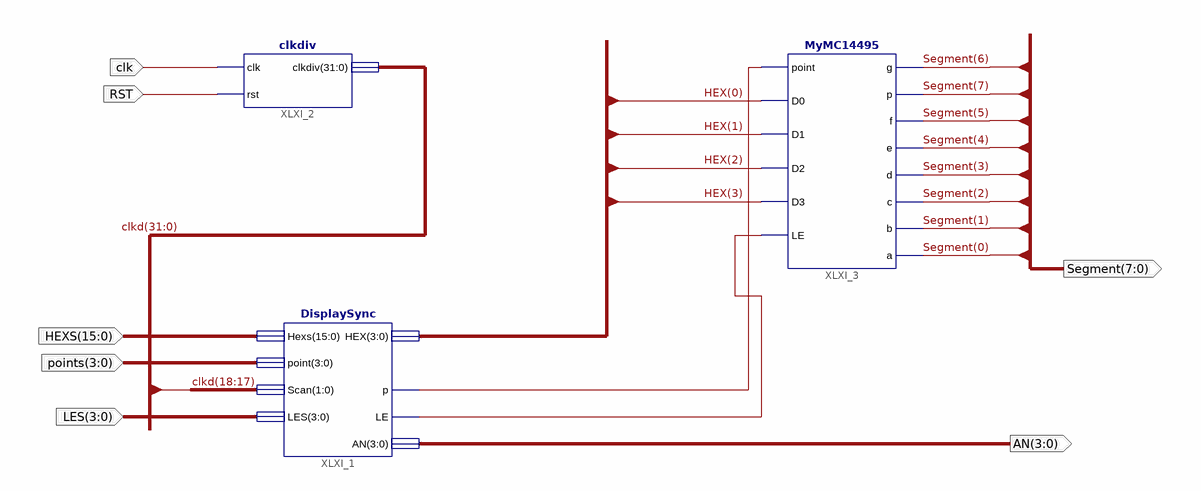
[diagram p0: schematic sheet 1]
// Xilinx ISE schematic DispNum_sch.sch (kintex7) as structural Verilog: 3 symbols, 7 ports
module DispNum_sch (
  input  clk,
  input  RST,
  input  [15:0] HEXS,
  input  [3:0] points,
  input  [3:0] LES,
  output [3:0] AN,
  output [7:0] Segment
);

  wire XLXN_15, XLXN_17;
  wire [3:0] HEX;
  wire [31:0] clkd;

  DisplaySync XLXI_1 (
    .Hexs(HEXS), .point(points), .Scan(clkd[18:17]), .LES(LES), .HEX(HEX), .p(XLXN_15), .LE(XLXN_17), .AN(AN));
  clkdiv XLXI_2 (.clk(clk), .rst(RST), .clkdiv(clkd));
  MyMC14495 XLXI_3 (
    .point(XLXN_15), .D0(HEX[0]), .D1(HEX[1]), .D2(HEX[2]), .D3(HEX[3]), .LE(XLXN_17), .g(Segment[6]),
    .p(Segment[7]), .f(Segment[5]), .e(Segment[4]), .d(Segment[3]), .c(Segment[2]), .b(Segment[1]),
    .a(Segment[0]));
endmodule
